# EAGLE design main (EAGLE 8.1.0)
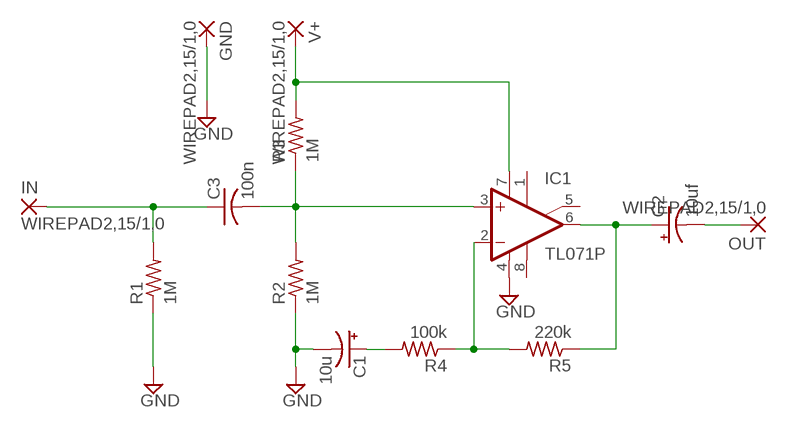
[diagram p0: schematic, sheet 1]

## Parts
C1  10u  CPOL-USC  [PANASONIC_C]
C2  10uf  CPOL-USC  [PANASONIC_C]
C3  100n  C-USC0805  [C0805]
GND  WIREPAD2,15/1,0  [2,15/1,0]
IC1  TL071P  [DIL08]
IN  WIREPAD2,15/1,0  [2,15/1,0]
OUT  WIREPAD2,15/1,0  [2,15/1,0]
R1  1M  R-US_R0805  [R0805]
R2  1M  R-US_R0805  [R0805]
R3  1M  R-US_R0805  [R0805]
R4  100k  R-US_R0805  [R0805]
R5  220k  R-US_R0805  [R0805]
V+  WIREPAD2,15/1,0  [2,15/1,0]

## Nets
GND: C1.- GND.1(P) IC1.4(V-) R1.1 R2.1
N$1: C3.2 IC1.3(+IN) R2.2 R3.1
N$2: C2.- OUT.1(P)
N$3: C1.+ R4.2
N$4: IC1.2(-IN) R4.1 R5.2
N$5: C2.+ IC1.6(OUT) R5.1
N$6: IC1.7(V+) R3.2 V+.1(P)
N$7: C3.1 IN.1(P) R1.2
Unconnected: IC1.1(ON1) IC1.5(ON2) IC1.8(OPT)

## Library data of the parts
C1 C2 = rcl:CPOL-US: POLARIZED CAPACITOR, American symbol
C3 = rcl:C-US: CAPACITOR, American symbol
GND IN OUT V+ = wirepad:WIREPAD: Wire PAD connect wire on PCB
IC1 = linear:TL071: OP AMP
R1-R5 = rcl:R-US_: RESISTOR, American symbol

## Board
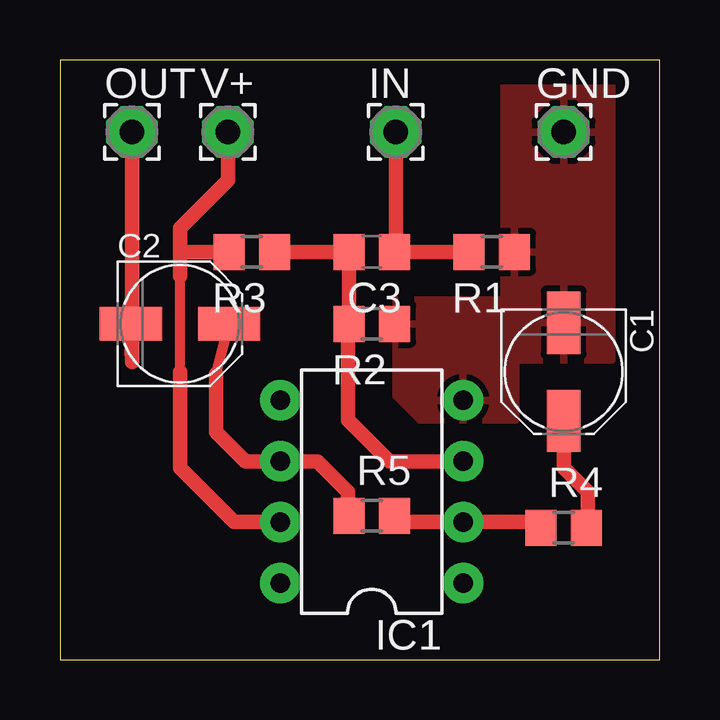
[diagram p1: board, top side]

Size 25 x 25 mm. Coordinates in mm from the lower left corner, seen from the top.
Outline: 0,0 25,0 25,25 0,25 0,0
Copper layers (1*16): Top 0.035mm / dielectric 1.5mm / Bottom 0.035mm
Design rules "default": minimum track width 10mil, minimum drill 24mil, track to track 8mil, track to pad 8mil, pad to pad 8mil, via to via 8mil, smd to smd 8mil, copper to edge 40mil, drill to drill 8mil, minimum pad ring 10mil, minimum via ring 8mil, stop-mask expansion 4mil, vias tented up to drill 0mil, thermal gap 10mil

### Footprints (pad centres in the part's own frame; a part is rotated, then mirrored left to right if it is on the bottom)
PANASONIC_C = smd 2.6 x 1.4: + 2.05,0; - -2.05,0
C0805 = smd 1.3 x 1.5: 1 -0.95,0; 2 0.95,0
2,15/1,0 = drill 1.016 pad 2.159 octagon: 1 0,0
DIL08 = drill 0.813 pad 1.676: 1 -3.81,-3.81; 2 -1.27,-3.81; 3 1.27,-3.81; 4 3.81,-3.81; 5 3.81,3.81; 6 1.27,3.81; 7 -1.27,3.81; 8 -3.81,3.81
R0805 = smd 1.3 x 1.5: 1 -0.95,0; 2 0.95,0

### Placement (x,y rotation side)
C1  21,12 270 top
C2  5,14 0 top
C3  13,17 180 top
GND  21,22 0 top
IC1  13,7 90 top
IN  14,22 0 top
OUT  3,22 0 top
R1  18,17 180 top
R2  13,14 180 top
R3  8,17 180 top
R4  21,5.5 0 top
R5  13,6 0 top
V+  7,22 0 top

### Tracks (layer width: path | path; a pad name or v marks a point on that pad's centre or on a via)
GND
  Top 0.406: R2.1 14,13.95
  pour Top: 18.5,17 18.5,22 18.5,24 23,24 23,12.5 19.5,12.5 19,12.5 19,10 15,10 14,11 14,15 18.5,15
N$1
  Top 0.406: R2.2 12,13.95
  Top 0.61: IC1.3 13.73,8.27 12,10 12,13.95 | R3.1 C3.2 R2.2
N$2
  Top 0.61: OUT.1 3,12.4 C2.-
N$3
  Top 0.61: C1.+ 21,8 22,7 22,5.55 R4.2
N$4
  Top 0.61: R5.2 14.22,5.73 IC1.2 18,5.73 | 18,5.73 18.27,5.73 | 18,5.73 20.05,5.73 R4.1
N$5
  Top 0.406: 6.5,11.9 C2.+
  Top 0.61: 6.5,11.9 6.5,9.5 7.73,8.27 IC1.6 10.73,8.27 12,7 12,6.05 R5.1
N$6
  Top 0.406: 5,12 5,16
  Top 0.61: IC1.7 7.27,5.73 5,8 5,12 | V+.1 7,20 5,18 5,17 | 5,17 5,16 | R3.2 5,17
N$7
  Top 0.406: 14,17.05 C3.1
  Top 0.61: R1.2 C3.1 | IN.1 14,17.05